# EAGLE schematic TacitusC (EAGLE 6.5.0)
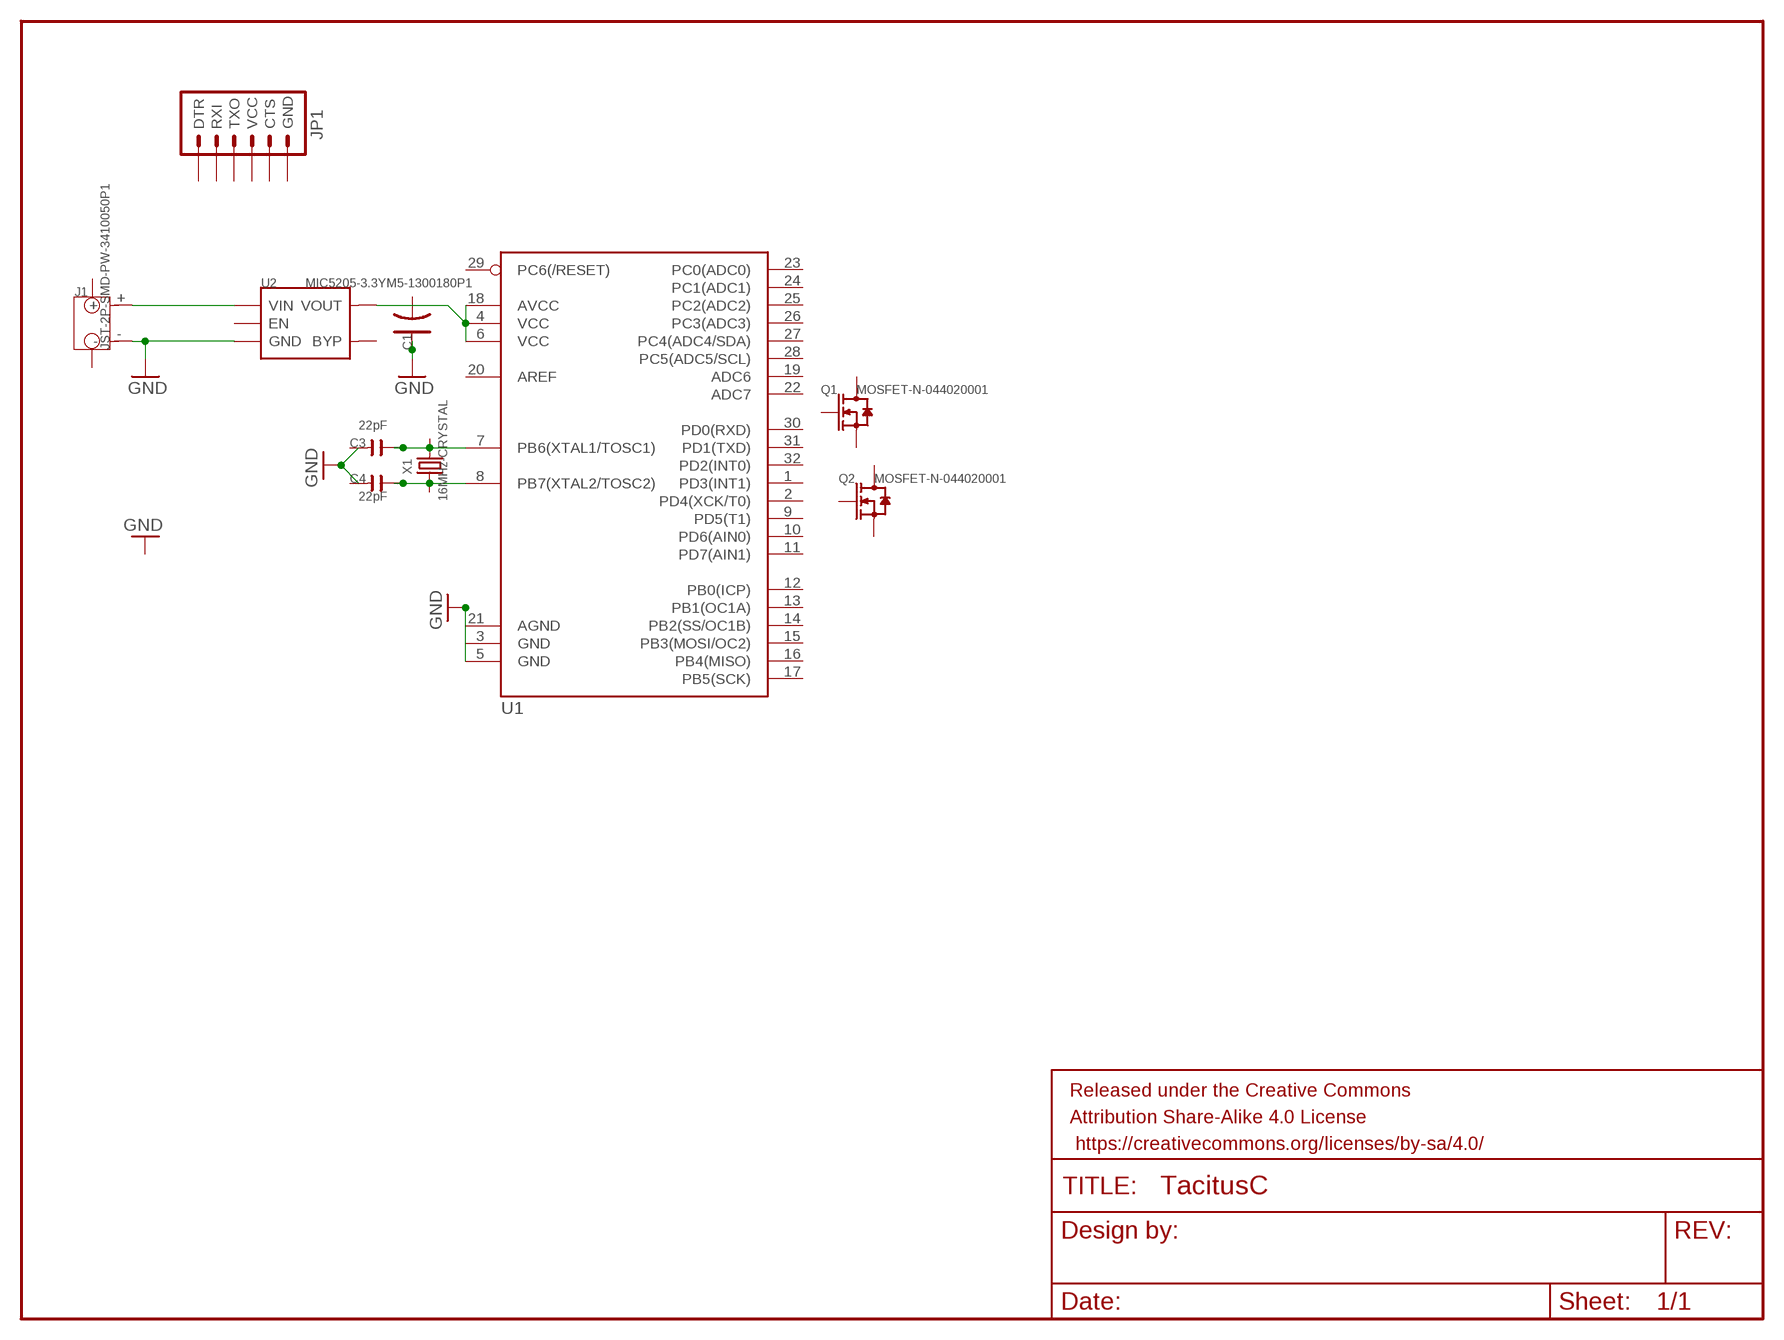
[diagram p0: schematic, sheet 1]

## Parts
C1  C-POLAR-A  [AVX-A]
C3  22pF  C-0603  [C0603]
C4  22pF  C-0603  [C0603]
FRAME1  FRAME-LETTER  [CREATIVE_COMMONS]
J1  JST-2P-SMD-PW-3410050P1  [2P-SMD-2.0-90D]
JP1  ARDUINO_SERIAL_PROGRAMPTH  [1X06]
Q1  MOSFET-N-044020001  [SOT23]
Q2  MOSFET-N-044020001  [SOT23]
U1  ATMEGA328_SMT  [TQFP32-08]
U2  MIC5205-3.3YM5-1300180P1  [SOT23-5]
X1  16MHz-CRYSTAL  CRYSTAL-0500290P1  [2P-SMD-5.0X3.2]

## Nets
GND: C1.+ J1.- U1.3(GND) U1.5(GND) U1.21(AGND) U2.2(GND)
N$1: J1.+ U2.1(VIN)
N$2: C4.2 U1.8(PB7(XTAL2/TOSC2))
N$3: C3.2 U1.7(PB6(XTAL1/TOSC1))
N$5: U1.4(VCC) U1.6(VCC) U1.18(AVCC) U2.5(VOUT)
Unconnected: C1.- C3.1 C4.1 J1.3 J1.4 JP1.1(DTR) JP1.2(RXI) JP1.3(TXO) JP1.4(VCC) JP1.5(CTS) JP1.6(GND) Q1.1(G) Q1.2(S) Q1.3(D) Q2.1(G) Q2.2(S) Q2.3(D) U1.1(PD3(INT1)) U1.2(PD4(XCK/T0)) U1.9(PD5(T1)) U1.10(PD6(AIN0)) U1.11(PD7(AIN1)) U1.12(PB0(ICP)) U1.13(PB1(OC1A)) U1.14(PB2(SS/OC1B)) U1.15(PB3(MOSI/OC2)) U1.16(PB4(MISO)) U1.17(PB5(SCK)) U1.19(ADC6) U1.20(AREF) U1.22(ADC7) U1.23(PC0(ADC0)) U1.24(PC1(ADC1)) U1.25(PC2(ADC2)) U1.26(PC3(ADC3)) U1.27(PC4(ADC4/SDA)) U1.28(PC5(ADC5/SCL)) U1.29(PC6(/RESET)) U1.30(PD0(RXD)) U1.31(PD1(TXD)) U1.32(PD2(INT0)) U2.3(EN) U2.4(BYP) X1.1 X1.2

## Library data of the parts
C1 = OPL Eagle Library:C-POLAR*
C3 C4 = OPL Eagle Library:C*
FRAME1 = SparkFun-Aesthetics:FRAME-LETTER: Schematic Frame Standard 8.5x11 US Letter frame
J1 = OPL Eagle Library:JST-2P-SMD-PW
JP1 = SparkFun-Connectors:ARDUINO_SERIAL_PROGRAM: FTDI connector footprints
Q1 Q2 = OPL Eagle Library:MOSFET-N: CJ2302：SMD MOSFET N-CH 20V-2.1A
U1 = SparkFun-DigitalIC:ATMEGA328_SMT: 32-Pin Atmega328 part Commonly used on Arduino compatible boards Available in QFP and QFN packages TQFP is IC-09069 QFN is non-stock; PROD_ID: IC-09069; VALUE: ATMEGA328P
U2 = OPL Eagle Library:MIC5205-3.3YM5: The MIC5205 is an efficient linear voltage regulator with ultra-low-noise output, very low dropout voltage (typically 17mV at light loads and 165mV at 150mA), and very low ground current (600µA at 100mA output). The MIC5205 offers better than 1% initial accuracy. datasheet here: http://www.micrel.com/product-info/prod/5205.shtml
X1 = OPL Eagle Library:CRYSTAL*